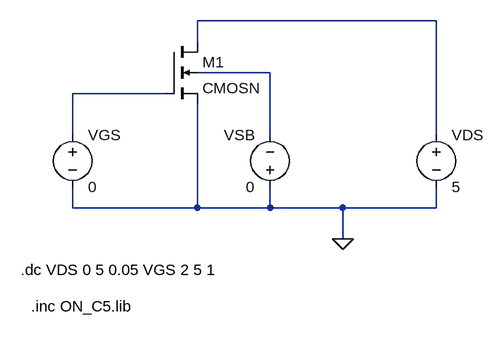
[diagram p0: schematic prob_1.asc]
prob_1.asc, the LTspice schematic file:
Version 4
SHEET 1 880 680
WIRE 480 -48 112 -48
WIRE 112 -16 112 -48
WIRE 224 32 112 32
WIRE 64 64 -80 64
WIRE -80 128 -80 64
WIRE 224 128 224 32
WIRE 480 128 480 -48
WIRE -80 240 -80 208
WIRE 112 240 112 80
WIRE 112 240 -80 240
WIRE 224 240 224 208
WIRE 224 240 112 240
WIRE 336 240 224 240
WIRE 480 240 480 208
WIRE 480 240 336 240
WIRE 336 288 336 240
FLAG 336 288 0
SYMBOL voltage -80 112 R0
WINDOW 123 0 0 Left 2
WINDOW 39 0 0 Left 2
SYMATTR InstName VGS
SYMATTR Value 0
SYMBOL voltage 480 112 R0
WINDOW 123 0 0 Left 2
WINDOW 39 0 0 Left 2
SYMATTR InstName VDS
SYMATTR Value 5
SYMBOL voltage 224 224 R180
WINDOW 0 24 96 Left 2
WINDOW 3 24 16 Left 2
WINDOW 123 0 0 Left 2
WINDOW 39 0 0 Left 2
SYMATTR InstName VSB
SYMATTR Value 0
SYMBOL nmos4 64 -16 R0
SYMATTR InstName M1
SYMATTR Value CMOSN
SYMATTR Value2 l=0.6u w=7.2u
TEXT -160 336 Left 2 !.dc VDS 0 5 0.05 VGS 2 5 1
TEXT -144 392 Left 2 !.inc ON_C5.lib

The netlist it stands for:
* prob_1.asc
VGS N003 0 0
VDS N001 0 5
VSB 0 N002 0
M1 N001 N003 0 N002 CMOSN l=0.6u w=7.2u
.model NMOS NMOS
.model PMOS PMOS
.lib standard.mos
.dc VDS 0 5 0.05 VGS 2 5 1
.inc ON_C5.lib
.backanno
.end